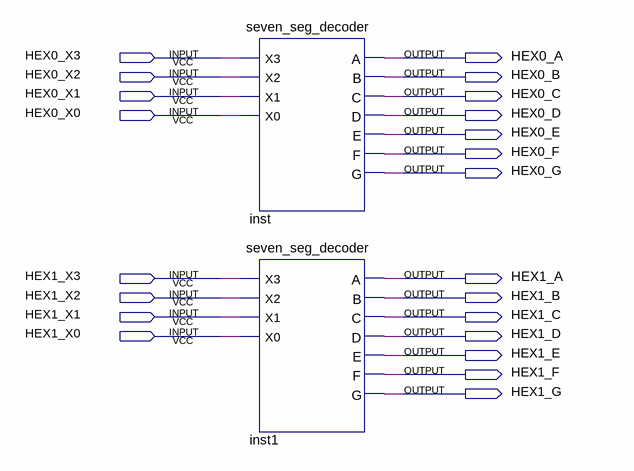
[diagram p0: schematic sheet]
// Quartus schematic lab5_1.bdf as structural Verilog: 2 symbols, 22 pins
module lab5_1 (
  input  HEX0_X3,
  input  HEX0_X2,
  input  HEX0_X1,
  input  HEX0_X0,
  input  HEX1_X3,
  input  HEX1_X2,
  input  HEX1_X1,
  input  HEX1_X0,
  output HEX0_A,
  output HEX0_B,
  output HEX0_C,
  output HEX0_D,
  output HEX0_E,
  output HEX0_F,
  output HEX0_G,
  output HEX1_A,
  output HEX1_B,
  output HEX1_C,
  output HEX1_D,
  output HEX1_E,
  output HEX1_F,
  output HEX1_G
);

  seven_seg_decoder inst (
    .X3(HEX0_X3), .X2(HEX0_X2), .X1(HEX0_X1), .X0(HEX0_X0), .A(HEX0_A), .B(HEX0_B), .C(HEX0_C), .D(HEX0_D),
    .E(HEX0_E), .F(HEX0_F), .G(HEX0_G));
  seven_seg_decoder inst1 (
    .X3(HEX1_X3), .X2(HEX1_X2), .X1(HEX1_X1), .X0(HEX1_X0), .A(HEX1_A), .B(HEX1_B), .C(HEX1_C), .D(HEX1_D),
    .E(HEX1_E), .F(HEX1_F), .G(HEX1_G));
endmodule
